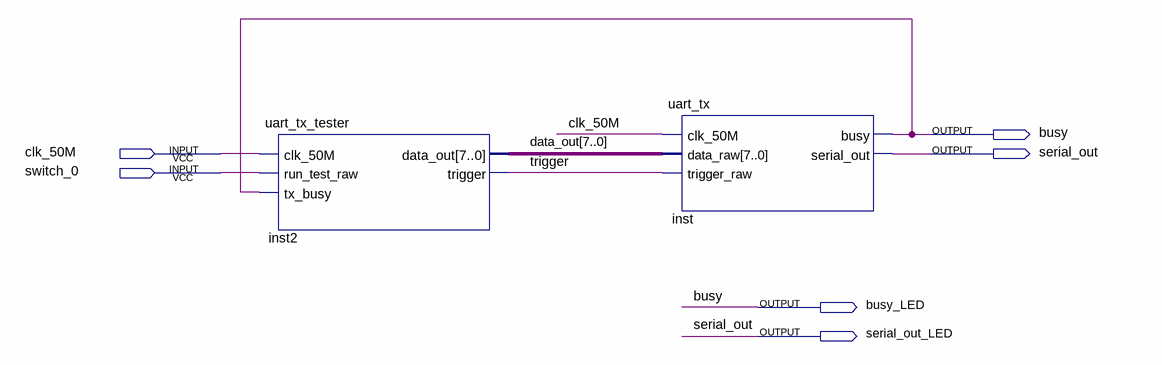
[diagram p0: schematic sheet]
// Quartus schematic uart_transmitter_top.bdf as structural Verilog: 2 symbols, 6 pins
module uart_transmitter_top (
  input  clk_50M,
  input  switch_0,
  output busy,
  output serial_out,
  output busy_LED,
  output serial_out_LED
);

  wire trigger;
  wire [7:0] data_out;

  uart_tx_tester inst2 (
    .clk_50M(clk_50M), .run_test_raw(switch_0), .tx_busy(busy), .data_out(data_out), .trigger(trigger));
  uart_tx inst (.clk_50M(clk_50M), .data_raw(data_out), .trigger_raw(trigger), .busy(busy), .serial_out(serial_out));

  assign busy_LED = busy;
  assign serial_out_LED = serial_out;
endmodule
